# Altium project 2026MM.PrjPcb (part 7 of 10)
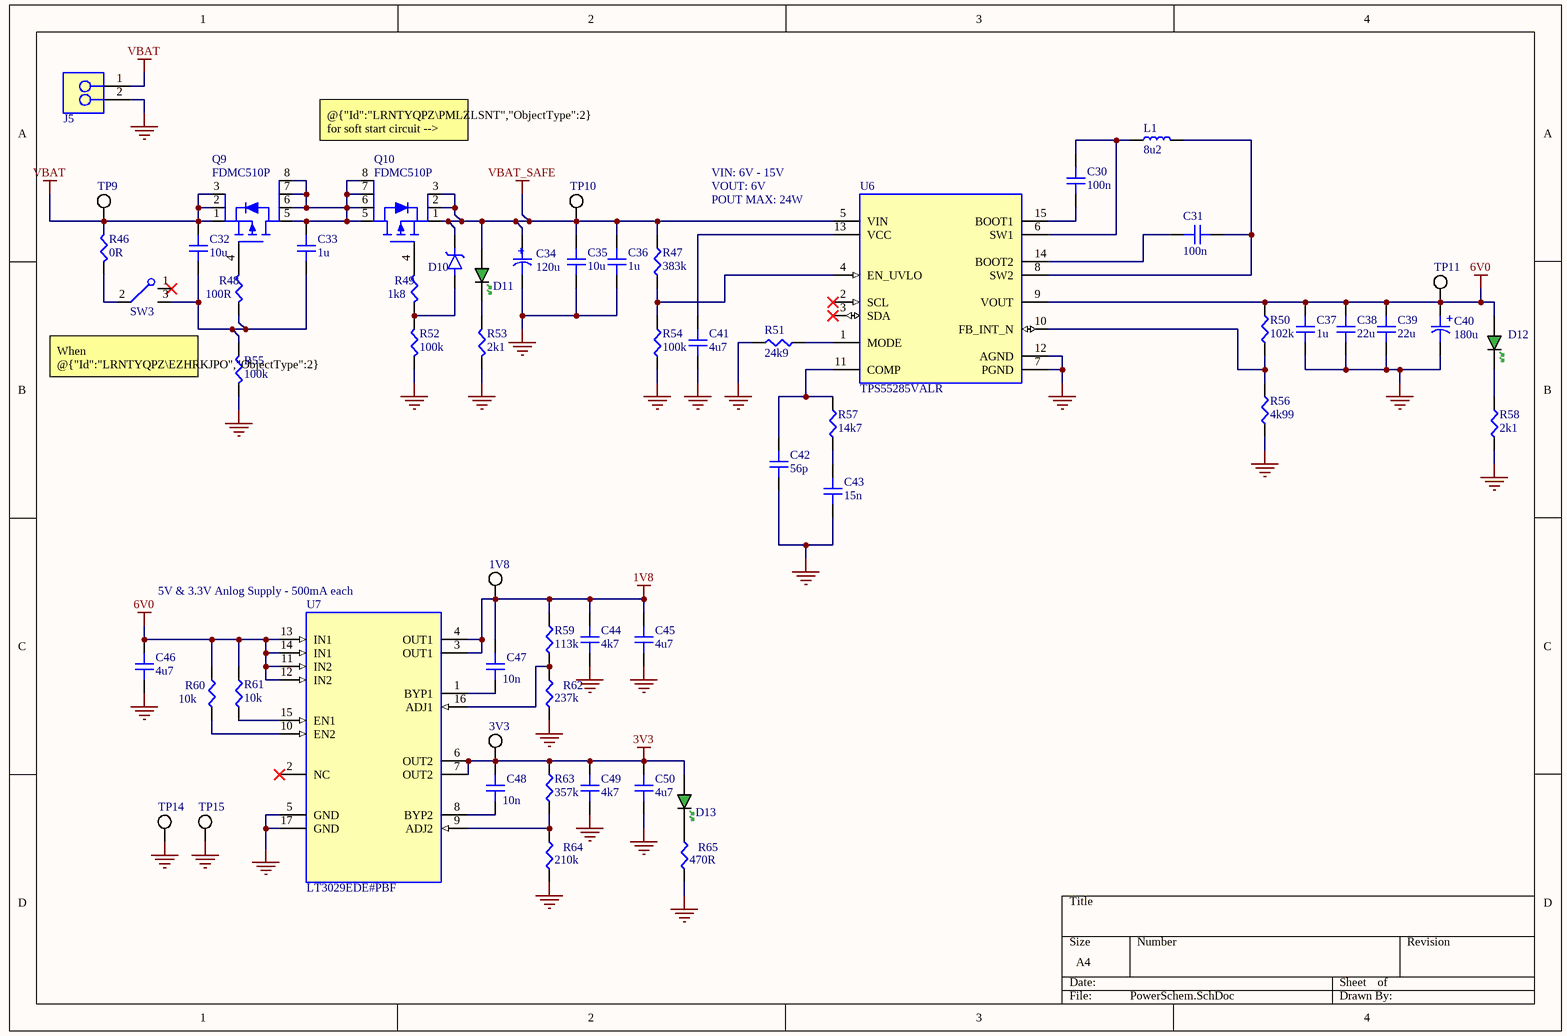
[diagram p7: PowerSchem.SchDoc]

## Sheet PowerSchem.SchDoc (continued)

### Library data of the parts (continued)
  C45: Value: 4u7; ComponentLink1URL: https://datasheet.octopart.com:443/CL05A475MO5NUNC-Samsung-Electro-Mechanics-datasheet-178175196.pdf?src-supplier=Farnell; ComponentLink1Description: https://datasheet.octopart.com:443/CL05A475MO5NUNC-Samsung-Electro-Mechanics-datasheet-178175196.pdf?src-supplier=Farnell; ComponentLink2URL: https://datasheet.octopart.com:443/CL05A475MO5NUNC-Samsung-Electro-Mechanics-datasheet-123102911.pdf?src-supplier=Future+Electronics; ComponentLink2Description: https://datasheet.octopart.com:443/CL05A475MO5NUNC-Samsung-Electro-Mechanics-datasheet-123102911.pdf?src-supplier=Future+Electronics; ComponentLink3URL: https://datasheet.octopart.com:443/CL05A475MO5NUNC-Samsung-Electro-Mechanics-datasheet-110226225.pdf?src-supplier=Future+Electronics; ComponentLink3Description: https://datasheet.octopart.com:443/CL05A475MO5NUNC-Samsung-Electro-Mechanics-datasheet-110226225.pdf?src-supplier=Future+Electronics; ComponentLink4URL: https://datasheet.octopart.com:443/CL05A475MO5NUNC-Samsung-Electro-Mechanics-datasheet-83567908.pdf?src-supplier=Future+Electronics; ComponentLink4Description: https://datasheet.octopart.com:443/CL05A475MO5NUNC-Samsung-Electro-Mechanics-datasheet-83567908.pdf?src-supplier=Future+Electronics; ComponentLink5URL: https://datasheet.octopart.com:443/CL05A475MO5NUNC-Samsung-Electro-Mechanics-datasheet-68297032.pdf?src-supplier=Future+Electronics; ComponentLink5Description: https://datasheet.octopart.com:443/CL05A475MO5NUNC-Samsung-Electro-Mechanics-datasheet-68297032.pdf?src-supplier=Future+Electronics; ComponentLink6URL: https://datasheet.octopart.com:443/CL05A475MO5NUNC-Samsung-Electro-Mechanics-datasheet-87580057.pdf?src-supplier=Future+Electronics; ComponentLink6Description: https://datasheet.octopart.com:443/CL05A475MO5NUNC-Samsung-Electro-Mechanics-datasheet-87580057.pdf?src-supplier=Future+Electronics; ComponentLink7URL: https://datasheet.octopart.com:443/CL05A475MO5NUNC-Samsung-Electro-Mechanics-datasheet-149136694.pdf?src-supplier=Future+Electronics; ComponentLink7Description: https://datasheet.octopart.com:443/CL05A475MO5NUNC-Samsung-Electro-Mechanics-datasheet-149136694.pdf?src-supplier=Future+Electronics; ComponentLink8URL: https://datasheet.octopart.com:443/GRM188R61E475KE11D-Murata-datasheet-27203393.pdf?src-supplier=Newark; ComponentLink8Description: https://datasheet.octopart.com:443/GRM188R61E475KE11D-Murata-datasheet-27203393.pdf?src-supplier=Newark; ComponentLink9URL: https://datasheet.octopart.com:443/GRM188R61E475KE11D-Murata-datasheet-44506546.pdf?src-supplier=Newark; ComponentLink9Description: https://datasheet.octopart.com:443/GRM188R61E475KE11D-Murata-datasheet-44506546.pdf?src-supplier=Newark; ComponentLink10URL: https://datasheet.octopart.com:443/GRM188R61E475KE11D-Murata-datasheet-62317199.pdf?src-supplier=element14+APAC; ComponentLink10Description: https://datasheet.octopart.com:443/GRM188R61E475KE11D-Murata-datasheet-62317199.pdf?src-supplier=element14+APAC; ComponentLink11URL: https://datasheet.octopart.com:443/GRM188R61E475KE11D-Murata-datasheet-14397282.pdf?src-supplier=Future+Electronics; ComponentLink11Description: https://datasheet.octopart.com:443/GRM188R61E475KE11D-Murata-datasheet-14397282.pdf?src-supplier=Future+Electronics; ComponentLink12URL: https://datasheet.octopart.com:443/GRM188R61E475KE11D-Murata-datasheet-78375012.pdf?src-supplier=Future+Electronics; ComponentLink12Description: https://datasheet.octopart.com:443/GRM188R61E475KE11D-Murata-datasheet-78375012.pdf?src-supplier=Future+Electronics; ComponentLink13URL: https://datasheet.octopart.com:443/GRM188R61E475KE11D-Murata-datasheet-179108037.pdf?src-supplier=Arrow.cn; ComponentLink13Description: https://datasheet.octopart.com:443/GRM188R61E475KE11D-Murata-datasheet-179108037.pdf?src-supplier=Arrow.cn; ComponentLink14URL: https://datasheet.octopart.com:443/GRM188R61E475KE11D-Murata-datasheet-165579666.pdf?src-supplier=TME; ComponentLink14Description: https://datasheet.octopart.com:443/GRM188R61E475KE11D-Murata-datasheet-165579666.pdf?src-supplier=TME; ComponentLink15URL: https://datasheet.octopart.com:443/GRM188R61E475KE11D-Murata-datasheet-141274968.pdf?src-supplier=Ciiva; ComponentLink15Description: https://datasheet.octopart.com:443/GRM188R61E475KE11D-Murata-datasheet-141274968.pdf?src-supplier=Ciiva; ComponentLink16URL: https://datasheet.octopart.com:443/GRM188R61E475KE11D-Murata-datasheet-140705133.pdf?src-supplier=Ciiva; ComponentLink16Description: https://datasheet.octopart.com:443/GRM188R61E475KE11D-Murata-datasheet-140705133.pdf?src-supplier=Ciiva; ComponentLink17URL: https://datasheet.octopart.com:443/GRM188R61E475KE11D-Murata-datasheet-138742897.pdf?src-supplier=Ciiva; ComponentLink17Description: https://datasheet.octopart.com:443/GRM188R61E475KE11D-Murata-datasheet-138742897.pdf?src-supplier=Ciiva; ComponentLink18URL: https://datasheet.octopart.com/GRM188R61E475KE11D-Murata-datasheet-12515295.pdf; ComponentLink18Description: https://datasheet.octopart.com/GRM188R61E475KE11D-Murata-datasheet-12515295.pdf; ComponentLink19URL: https://datasheet.octopart.com/GRM188R61E475KE11D-Murata-datasheet-12510076.pdf; ComponentLink19Description: https://datasheet.octopart.com/GRM188R61E475KE11D-Murata-datasheet-12510076.pdf; ComponentLink20URL: https://datasheet.octopart.com/GRM188R61E475KE11D-Murata-datasheet-11978611.pdf; ComponentLink20Description: https://datasheet.octopart.com/GRM188R61E475KE11D-Murata-datasheet-11978611.pdf; ComponentLink21URL: https://datasheet.octopart.com/GRM188R61E475KE11D-Murata-datasheet-10025737.pdf; ComponentLink21Description: https://datasheet.octopart.com/GRM188R61E475KE11D-Murata-datasheet-10025737.pdf; ComponentLink22URL: https://datasheet.octopart.com/GRM188R61E475KE11D-Murata-datasheet-8819587.pdf; ComponentLink22Description: https://datasheet.octopart.com/GRM188R61E475KE11D-Murata-datasheet-8819587.pdf; ComponentLink23URL: http://sigma.octopart.com:80/reach_statement/Murata-company-16.pdf?src-supplier=Compliance+Statements; ComponentLink23Description: http://sigma.octopart.com:80/reach_statement/Murata-company-16.pdf?src-supplier=Compliance+Statements; ComponentLink24URL: https://datasheet.octopart.com:443/GRT188C81E475KE13D-Murata-datasheet-149523579.pdf?src-supplier=Farnell; ComponentLink24Description: https://datasheet.octopart.com:443/GRT188C81E475KE13D-Murata-datasheet-149523579.pdf?src-supplier=Farnell; ComponentLink25URL: https://datasheet.octopart.com:443/GRT188C81E475KE13D-Murata-datasheet-67697744.pdf?src-supplier=Newark; ComponentLink25Description: https://datasheet.octopart.com:443/GRT188C81E475KE13D-Murata-datasheet-67697744.pdf?src-supplier=Newark; ComponentLink26URL: https://datasheet.octopart.com:443/GRT188C81E475KE13D-Murata-datasheet-141284540.pdf?src-supplier=Geoflip; ComponentLink26Description: https://datasheet.octopart.com:443/GRT188C81E475KE13D-Murata-datasheet-141284540.pdf?src-supplier=Geoflip; ComponentLink27URL: https://datasheet.octopart.com:443/GRT188C81E475KE13D-Murata-datasheet-165579666.pdf?src-supplier=TME; ComponentLink27Description: https://datasheet.octopart.com:443/GRT188C81E475KE13D-Murata-datasheet-165579666.pdf?src-supplier=TME; ComponentLink28URL: https://datasheet.octopart.com:443/GRT188C81E475KE13D-Murata-datasheet-140711288.pdf?src-supplier=Ciiva; ComponentLink28Description: https://datasheet.octopart.com:443/GRT188C81E475KE13D-Murata-datasheet-140711288.pdf?src-supplier=Ciiva; ComponentLink29URL: https://datasheet.octopart.com:443/GRT188C81E475KE13D-Murata-datasheet-138749062.pdf?src-supplier=Ciiva; ComponentLink29Description: https://datasheet.octopart.com:443/GRT188C81E475KE13D-Murata-datasheet-138749062.pdf?src-supplier=Ciiva
  C50: Value: 4u7; ComponentLink13URL: https://datasheet.octopart.com:443/GRM188R61E475KE11D-Murata-datasheet-179108037.pdf?src-supplier=Arrow.cn; ComponentLink13Description: https://datasheet.octopart.com:443/GRM188R61E475KE11D-Murata-datasheet-179108037.pdf?src-supplier=Arrow.cn; ComponentLink14URL: https://datasheet.octopart.com:443/GRM188R61E475KE11D-Murata-datasheet-165579666.pdf?src-supplier=TME; ComponentLink14Description: https://datasheet.octopart.com:443/GRM188R61E475KE11D-Murata-datasheet-165579666.pdf?src-supplier=TME; ComponentLink15URL: https://datasheet.octopart.com:443/GRM188R61E475KE11D-Murata-datasheet-141274968.pdf?src-supplier=Ciiva; ComponentLink15Description: https://datasheet.octopart.com:443/GRM188R61E475KE11D-Murata-datasheet-141274968.pdf?src-supplier=Ciiva; ComponentLink16URL: https://datasheet.octopart.com:443/GRM188R61E475KE11D-Murata-datasheet-140705133.pdf?src-supplier=Ciiva; ComponentLink16Description: https://datasheet.octopart.com:443/GRM188R61E475KE11D-Murata-datasheet-140705133.pdf?src-supplier=Ciiva; ComponentLink17URL: https://datasheet.octopart.com:443/GRM188R61E475KE11D-Murata-datasheet-138742897.pdf?src-supplier=Ciiva; ComponentLink17Description: https://datasheet.octopart.com:443/GRM188R61E475KE11D-Murata-datasheet-138742897.pdf?src-supplier=Ciiva; ComponentLink18URL: https://datasheet.octopart.com/GRM188R61E475KE11D-Murata-datasheet-12515295.pdf; ComponentLink18Description: https://datasheet.octopart.com/GRM188R61E475KE11D-Murata-datasheet-12515295.pdf; ComponentLink19URL: https://datasheet.octopart.com/GRM188R61E475KE11D-Murata-datasheet-12510076.pdf; ComponentLink19Description: https://datasheet.octopart.com/GRM188R61E475KE11D-Murata-datasheet-12510076.pdf; ComponentLink20URL: https://datasheet.octopart.com/GRM188R61E475KE11D-Murata-datasheet-11978611.pdf; ComponentLink20Description: https://datasheet.octopart.com/GRM188R61E475KE11D-Murata-datasheet-11978611.pdf; ComponentLink21URL: https://datasheet.octopart.com/GRM188R61E475KE11D-Murata-datasheet-10025737.pdf; ComponentLink21Description: https://datasheet.octopart.com/GRM188R61E475KE11D-Murata-datasheet-10025737.pdf; ComponentLink22URL: https://datasheet.octopart.com/GRM188R61E475KE11D-Murata-datasheet-8819587.pdf; ComponentLink22Description: https://datasheet.octopart.com/GRM188R61E475KE11D-Murata-datasheet-8819587.pdf; ComponentLink23URL: http://sigma.octopart.com:80/reach_statement/Murata-company-16.pdf?src-supplier=Compliance+Statements; ComponentLink23Description: http://sigma.octopart.com:80/reach_statement/Murata-company-16.pdf?src-supplier=Compliance+Statements; ComponentLink1URL: https://datasheet.octopart.com:443/GRT188C81E475KE13D-Murata-datasheet-149523579.pdf?src-supplier=Farnell; ComponentLink1Description: https://datasheet.octopart.com:443/GRT188C81E475KE13D-Murata-datasheet-149523579.pdf?src-supplier=Farnell; ComponentLink2URL: https://datasheet.octopart.com:443/GRT188C81E475KE13D-Murata-datasheet-67697744.pdf?src-supplier=Newark; ComponentLink2Description: https://datasheet.octopart.com:443/GRT188C81E475KE13D-Murata-datasheet-67697744.pdf?src-supplier=Newark; ComponentLink3URL: https://datasheet.octopart.com:443/GRT188C81E475KE13D-Murata-datasheet-141284540.pdf?src-supplier=Geoflip; ComponentLink3Description: https://datasheet.octopart.com:443/GRT188C81E475KE13D-Murata-datasheet-141284540.pdf?src-supplier=Geoflip; ComponentLink4URL: https://datasheet.octopart.com:443/GRT188C81E475KE13D-Murata-datasheet-165579666.pdf?src-supplier=TME; ComponentLink4Description: https://datasheet.octopart.com:443/GRT188C81E475KE13D-Murata-datasheet-165579666.pdf?src-supplier=TME; ComponentLink5URL: https://datasheet.octopart.com:443/GRT188C81E475KE13D-Murata-datasheet-140711288.pdf?src-supplier=Ciiva; ComponentLink5Description: https://datasheet.octopart.com:443/GRT188C81E475KE13D-Murata-datasheet-140711288.pdf?src-supplier=Ciiva; ComponentLink6URL: https://datasheet.octopart.com:443/GRT188C81E475KE13D-Murata-datasheet-138749062.pdf?src-supplier=Ciiva; ComponentLink6Description: https://datasheet.octopart.com:443/GRT188C81E475KE13D-Murata-datasheet-138749062.pdf?src-supplier=Ciiva; ComponentLink7URL: http://sigma.octopart.com:80/reach_statement/Murata-company-16.pdf?src-supplier=Compliance+Statements; ComponentLink7Description: http://sigma.octopart.com:80/reach_statement/Murata-company-16.pdf?src-supplier=Compliance+Statements
C42 = CAP: Ceramic Capacitor, Multilayer, Ceramic, 250V, 5% +Tol, 5% -Tol, C0G, 30ppm/Cel TC, 5.6e-05uF, Surface Mount, 0603; Manufacturer: Knowles; Manufacturer Part Number: QSCP251Q560J1GV001T; Value: 56p; Supplier 1: DigiKey; Supplier Part Number 1: 712-QSCP251Q560J1GV001TCT-ND; RoHS: Compliant; Category: Ceramic Capacitors; Stock: 30631; Pricing: 1=0.28, 10=0.162, 50=0.1176, 100=0.1038, 500=0.08066, 1000=0.07352 (USD); Case/Package: 0603; Country of Origin: USA; Dielectric Material: Ceramic; Export Control Classification Number (ECCN) Code: EAR99; Height: 760µm; Harmonized Tariff Schedule (HTS) Code: 8532.24.00.20; Introduction Date: 2022-02-04; Length: 1.57mm; Lifecycle Status: Production; Max Operating Temperature: 125°C; Min Operating Temperature: -55°C; Mounting Technology: Surface Mount; Number of Terminals: 2; REACH SVHC: Yes; Voltage Rating (DC): 250V; Width: 810µm; ComponentLink1URL: https://datasheet.octopart.com:443/QSCP251Q560J1GV001T-Johanson-datasheet-187816102.pdf?src-supplier=IHS; ComponentLink1Description: https://datasheet.octopart.com:443/QSCP251Q560J1GV001T-Johanson-datasheet-187816102.pdf?src-supplier=IHS
C43 = CAP: 0603 C 15NF Ceramic Multilayer Capacitor, 25 V, +125DEGC, C0G Dielectric, +/-5%; Manufacturer: Yageo Group; Manufacturer Part Number: C0603C153J3GACTU; Dissipation Factor: 0.1%; Temperature Coefficient: 30ppm/°C; Tolerance: 5%; Voltage: 25V; Value: 15n; Supplier 1: Newark; Supplier Part Number 1: C0603C153J3GACTU; RoHS: Compliant; Category: Ceramic Capacitors; Stock: 31000; Pricing: 4000=0.087, 8000=0.084 (USD); Case/Package: 0603; Case Code (Imperial): 0603; Case Code (Metric): 1608; China RoHS: Compliant; Contact Plating: Tin; Country of Origin: Mexico; Depth: 800µm; Dielectric: C0G; Dielectric Material: Ceramic; Export Control Classification Number (ECCN) Code: EAR99; Height: 800µm; Harmonized Tariff Schedule (HTS) Code: 8532.24.00.20; Introduction Date: 2008-06-06; Lead Free: Lead Free; Length: 1.6mm; Lifecycle Status: Production; Material: Ceramic; Max Operating Temperature: 125°C; Min Operating Temperature: -55°C; Mounting Technology: Surface Mount; Pins: 2; Number of Terminals: 2; Packaging: Cut Tape; REACH SVHC: Yes; Schedule B: 8532240020, 8532240020|8532240020, 8532240020|8532240020|8532240020, 8532240020|8532240020|8532240020|8532240020; Termination: SMD/SMT; Thickness: 863.6µm; Voltage Rating: 25V; Voltage Rating (DC): 25V; Width: 800µm; ComponentLink1URL: https://datasheet.octopart.com:443/C0603C153J3GACTU-KEMET-datasheet-178132257.pdf?src-supplier=IHS; ComponentLink1Description: https://datasheet.octopart.com:443/C0603C153J3GACTU-KEMET-datasheet-178132257.pdf?src-supplier=IHS; ComponentLink2URL: https://datasheet.octopart.com:443/C0603C153J3GAC7867-KEMET-datasheet-10540709.pdf?src-supplier=IHS; ComponentLink2Description: https://datasheet.octopart.com:443/C0603C153J3GAC7867-KEMET-datasheet-10540709.pdf?src-supplier=IHS; ComponentLink3URL: https://datasheet.octopart.com:443/C0603C153J3GACTU-KEMET-datasheet-137357764.pdf?src-supplier=Upverter; ComponentLink3Description: https://datasheet.octopart.com:443/C0603C153J3GACTU-KEMET-datasheet-137357764.pdf?src-supplier=Upverter; ComponentLink4URL: https://datasheet.octopart.com:443/C0603C153J3GACTU-KEMET-datasheet-68331921.pdf?src-supplier=Farnell; ComponentLink4Description: https://datasheet.octopart.com:443/C0603C153J3GACTU-KEMET-datasheet-68331921.pdf?src-supplier=Farnell; ComponentLink5URL: https://datasheet.octopart.com:443/C0603C153J3GACTU-KEMET-datasheet-102648314.pdf?src-supplier=Farnell; ComponentLink5Description: https://datasheet.octopart.com:443/C0603C153J3GACTU-KEMET-datasheet-102648314.pdf?src-supplier=Farnell; ComponentLink6URL: https://datasheet.octopart.com:443/C0603C153J3GACTU-Kemet-datasheet-5308203.pdf?src-supplier=Farnell; ComponentLink6Description: https://datasheet.octopart.com:443/C0603C153J3GACTU-Kemet-datasheet-5308203.pdf?src-supplier=Farnell; ComponentLink7URL: https://datasheet.octopart.com:443/C0603C153J3GACTU-KEMET-datasheet-176289261.pdf?src-supplier=element14+APAC; ComponentLink7Description: https://datasheet.octopart.com:443/C0603C153J3GACTU-KEMET-datasheet-176289261.pdf?src-supplier=element14+APAC; ComponentLink8URL: https://datasheet.octopart.com:443/C0603C153J3GACTU-KEMET-datasheet-178087916.pdf?src-supplier=element14+APAC; ComponentLink8Description: https://datasheet.octopart.com:443/C0603C153J3GACTU-KEMET-datasheet-178087916.pdf?src-supplier=element14+APAC; ComponentLink9URL: https://datasheet.octopart.com:443/C0603C153J3GACTU-Kemet-datasheet-66093294.pdf?src-supplier=element14+APAC; ComponentLink9Description: https://datasheet.octopart.com:443/C0603C153J3GACTU-Kemet-datasheet-66093294.pdf?src-supplier=element14+APAC; ComponentLink10URL: https://datasheet.octopart.com:443/C0603C153J3GACTU-Kemet-datasheet-66634713.pdf?src-supplier=element14+APAC; ComponentLink10Description: https://datasheet.octopart.com:443/C0603C153J3GACTU-Kemet-datasheet-66634713.pdf?src-supplier=element14+APAC; ComponentLink11URL: https://datasheet.octopart.com:443/C0603C153J3GACTU-KEMET-datasheet-157246123.pdf?src-supplier=Electro+Sonic; ComponentLink11Description: https://datasheet.octopart.com:443/C0603C153J3GACTU-KEMET-datasheet-157246123.pdf?src-supplier=Electro+Sonic; ComponentLink12URL: https://datasheet.octopart.com:443/C0603C153J3GAC7867-KEMET-datasheet-188512010.pdf?src-supplier=ODG+(Origin+Data+Global); ComponentLink12Description: https://datasheet.octopart.com:443/C0603C153J3GAC7867-KEMET-datasheet-188512010.pdf?src-supplier=ODG+(Origin+Data+Global); ComponentLink13URL: https://datasheet.octopart.com:443/C0603C153J3GACTU-KEMET-datasheet-176142193.pdf?src-supplier=Newark; ComponentLink13Description: https://datasheet.octopart.com:443/C0603C153J3GACTU-KEMET-datasheet-176142193.pdf?src-supplier=Newark; ComponentLink14URL: https://datasheet.octopart.com:443/C0603C153J3GACTU-KEMET-datasheet-101575703.pdf?src-supplier=Newark; ComponentLink14Description: https://datasheet.octopart.com:443/C0603C153J3GACTU-KEMET-datasheet-101575703.pdf?src-supplier=Newark; ComponentLink15URL: https://datasheet.octopart.com:443/C0603C153J3GACTU-Kemet-datasheet-62307647.pdf?src-supplier=Newark; ComponentLink15Description: https://datasheet.octopart.com:443/C0603C153J3GACTU-Kemet-datasheet-62307647.pdf?src-supplier=Newark; ComponentLink16URL: https://datasheet.octopart.com:443/C0603C153J3GACTU-KEMET-datasheet-193515620.pdf?src-supplier=Newark; ComponentLink16Description: https://datasheet.octopart.com:443/C0603C153J3GACTU-KEMET-datasheet-193515620.pdf?src-supplier=Newark; ComponentLink17URL: https://datasheet.octopart.com:443/C0603C153J3GACTU-Kemet-datasheet-67830794.pdf?src-supplier=TME; ComponentLink17Description: https://datasheet.octopart.com:443/C0603C153J3GACTU-Kemet-datasheet-67830794.pdf?src-supplier=TME; ComponentLink18URL: https://datasheet.octopart.com/C0603C153J3GACTU-KEMET-datasheet-84169754.pdf; ComponentLink18Description: https://datasheet.octopart.com/C0603C153J3GACTU-KEMET-datasheet-84169754.pdf; ComponentLink19URL: https://datasheet.octopart.com:443/C0603C153J3GACTU-Kemet-datasheet-60243840.pdf?src-supplier=RS+(Formerly+Allied+Electronics); ComponentLink19Description: https://datasheet.octopart.com:443/C0603C153J3GACTU-Kemet-datasheet-60243840.pdf?src-supplier=RS+(Formerly+Allied+Electronics); ComponentLink20URL: http://sigma.octopart.com:80/conflict_mineral_statement/Yageo-company-3.pdf?src-supplier=Compliance+Statements; ComponentLink20Description: http://sigma.octopart.com:80/conflict_mineral_statement/Yageo-company-3.pdf?src-supplier=Compliance+Statements; ComponentLink21URL: http://sigma.octopart.com:80/rohs_statement/Yageo-company-2.pdf?src-supplier=Compliance+Statements; ComponentLink21Description: http://sigma.octopart.com:80/rohs_statement/Yageo-company-2.pdf?src-supplier=Compliance+Statements
C47 C48 = CAP: Multilayer Ceramic Capacitors Mlcc - Smd/Smt 50V 0.01Uf X7R 0603 10%; Manufacturer: Yageo Group; Manufacturer Part Number: C0603C103K5RACTU; Dissipation Factor: 2.5%; Temperature Coefficient: 30ppm/°C; Value: 10n; Supplier 1: Avnet; Supplier Part Number 1: C0603C103K5RACTU; RoHS: Compliant; Category: Ceramic Capacitors; Stock: 2208000; Pricing: 4000=0.00842, 8000=0.00823, 16000=0.00795, 32000=0.00764, 64000=0.00735 (USD); Case/Package: 0603; Case Code (Imperial): 0603; China RoHS: Compliant; Contact Plating: Tin; Country of Origin: Mainland China, Mexico; Depth: 800µm; Dielectric: X7R; Dielectric Material: Ceramic; Export Control Classification Number (ECCN) Code: EAR99; Height: 800µm; Harmonized Tariff Schedule (HTS) Code: 8532.24.00.20; Introduction Date: 2011-07-27; Lead Free: Lead Free; Lead Pitch: 700µm; Length: 1.6mm; Lifecycle Status: Production; Material: Ceramic; Max Operating Temperature: 125°C; Min Operating Temperature: -55°C; Mounting Technology: Surface Mount; Pins: 2; Number of Terminals: 2; Packaging: Cut Tape; Radiation Hardening: No; REACH SVHC: Yes; Schedule B: 8532240020, 8532240020|8532240020, 8532240020|8532240020|8532240020, 8532240020|8532240020|8532240020|8532240020; Termination: SMD/SMT; Thickness: 863.6µm; Tolerance: 10%; Voltage: 50V; Voltage Rating: 50V; Voltage Rating (DC): 50V; Width: 800µm; ComponentLink1URL: https://datasheet.octopart.com:443/C0603C103K5RACTU-KEMET-datasheet-178445679.pdf?src-supplier=Farnell; ComponentLink1Description: https://datasheet.octopart.com:443/C0603C103K5RACTU-KEMET-datasheet-178445679.pdf?src-supplier=Farnell; ComponentLink2URL: https://datasheet.octopart.com:443/C0603C103K5RACTU-KEMET-datasheet-137357759.pdf?src-supplier=Farnell; ComponentLink2Description: https://datasheet.octopart.com:443/C0603C103K5RACTU-KEMET-datasheet-137357759.pdf?src-supplier=Farnell; ComponentLink3URL: https://datasheet.octopart.com:443/C0603C103K5RACTU-KEMET-datasheet-149521831.pdf?src-supplier=Farnell; ComponentLink3Description: https://datasheet.octopart.com:443/C0603C103K5RACTU-KEMET-datasheet-149521831.pdf?src-supplier=Farnell; ComponentLink4URL: https://datasheet.octopart.com:443/C0603C103K5RAC-TU-Kemet-datasheet-12608295.pdf?src-supplier=Farnell; ComponentLink4Description: https://datasheet.octopart.com:443/C0603C103K5RAC-TU-Kemet-datasheet-12608295.pdf?src-supplier=Farnell; ComponentLink5URL: https://datasheet.octopart.com:443/C0603C103K5RAC-TU-Kemet-datasheet-11992184.pdf?src-supplier=Farnell; ComponentLink5Description: https://datasheet.octopart.com:443/C0603C103K5RAC-TU-Kemet-datasheet-11992184.pdf?src-supplier=Farnell; ComponentLink6URL: https://datasheet.octopart.com:443/C0603C103K5RAC-TU-Kemet-datasheet-10942409.pdf?src-supplier=Farnell; ComponentLink6Description: https://datasheet.octopart.com:443/C0603C103K5RAC-TU-Kemet-datasheet-10942409.pdf?src-supplier=Farnell; ComponentLink7URL: https://datasheet.octopart.com:443/C0603C103K5RAC-TU-Kemet-datasheet-10404442.pdf?src-supplier=Farnell; ComponentLink7Description: https://datasheet.octopart.com:443/C0603C103K5RAC-TU-Kemet-datasheet-10404442.pdf?src-supplier=Farnell; ComponentLink8URL: https://datasheet.octopart.com:443/C0603C103K5RACTU-KEMET-datasheet-101575646.pdf?src-supplier=Farnell; ComponentLink8Description: https://datasheet.octopart.com:443/C0603C103K5RACTU-KEMET-datasheet-101575646.pdf?src-supplier=Farnell; ComponentLink9URL: https://datasheet.octopart.com:443/C0603C103K5RACTU.-Kemet-datasheet-41232427.pdf?src-supplier=Farnell; ComponentLink9Description: https://datasheet.octopart.com:443/C0603C103K5RACTU.-Kemet-datasheet-41232427.pdf?src-supplier=Farnell; ComponentLink10URL: https://datasheet.octopart.com:443/C0603C103K5RACTU-KEMET-datasheet-176142155.pdf?src-supplier=Farnell; ComponentLink10Description: https://datasheet.octopart.com:443/C0603C103K5RACTU-KEMET-datasheet-176142155.pdf?src-supplier=Farnell; ComponentLink11URL: https://datasheet.octopart.com:443/C0603C103K5RAC-TU-Kemet-datasheet-7833651.pdf?src-supplier=Farnell; ComponentLink11Description: https://datasheet.octopart.com:443/C0603C103K5RAC-TU-Kemet-datasheet-7833651.pdf?src-supplier=Farnell; ComponentLink12URL: https://datasheet.octopart.com:443/C0603C103K5RAC-TU-Kemet-datasheet-7601896.pdf?src-supplier=Farnell; ComponentLink12Description: https://datasheet.octopart.com:443/C0603C103K5RAC-TU-Kemet-datasheet-7601896.pdf?src-supplier=Farnell; ComponentLink13URL: https://datasheet.octopart.com:443/C0603C103K5RAC-TU-Kemet-datasheet-5316294.pdf?src-supplier=Farnell; ComponentLink13Description: https://datasheet.octopart.com:443/C0603C103K5RAC-TU-Kemet-datasheet-5316294.pdf?src-supplier=Farnell; ComponentLink14URL: https://datasheet.octopart.com:443/C0603C103K5RAC-TU-Kemet-datasheet-5314837.pdf?src-supplier=Farnell; ComponentLink14Description: https://datasheet.octopart.com:443/C0603C103K5RAC-TU-Kemet-datasheet-5314837.pdf?src-supplier=Farnell; ComponentLink15URL: https://datasheet.octopart.com:443/C0603C103K5RAC-TU-Kemet-datasheet-8092359.pdf?src-supplier=Farnell; ComponentLink15Description: https://datasheet.octopart.com:443/C0603C103K5RAC-TU-Kemet-datasheet-8092359.pdf?src-supplier=Farnell; ComponentLink16URL: https://datasheet.octopart.com:443/C0603C103K5RACTU-Kemet-datasheet-5314449.pdf?src-supplier=Farnell; ComponentLink16Description: https://datasheet.octopart.com:443/C0603C103K5RACTU-Kemet-datasheet-5314449.pdf?src-supplier=Farnell; ComponentLink17URL: https://datasheet.octopart.com:443/C0603C103K5RAC-TU-Kemet-datasheet-5390537.pdf?src-supplier=Farnell; ComponentLink17Description: https://datasheet.octopart.com:443/C0603C103K5RAC-TU-Kemet-datasheet-5390537.pdf?src-supplier=Farnell; ComponentLink18URL: https://datasheet.octopart.com:443/C0603C103K5RAC-TU-Kemet-datasheet-5314969.pdf?src-supplier=Farnell; ComponentLink18Description: https://datasheet.octopart.com:443/C0603C103K5RAC-TU-Kemet-datasheet-5314969.pdf?src-supplier=Farnell; ComponentLink19URL: https://datasheet.octopart.com:443/C0603C103K5RAC-TU-Kemet-datasheet-5314627.pdf?src-supplier=Farnell; ComponentLink19Description: https://datasheet.octopart.com:443/C0603C103K5RAC-TU-Kemet-datasheet-5314627.pdf?src-supplier=Farnell; ComponentLink20URL: https://datasheet.octopart.com:443/C0603C103K5RAC-TU-Kemet-datasheet-5389132.pdf?src-supplier=Farnell; ComponentLink20Description: https://datasheet.octopart.com:443/C0603C103K5RAC-TU-Kemet-datasheet-5389132.pdf?src-supplier=Farnell; ComponentLink21URL: https://datasheet.octopart.com:443/C0603C103K5RAC-TU-Kemet-datasheet-5313836.pdf?src-supplier=Farnell; ComponentLink21Description: https://datasheet.octopart.com:443/C0603C103K5RAC-TU-Kemet-datasheet-5313836.pdf?src-supplier=Farnell; ComponentLink22URL: https://datasheet.octopart.com:443/C0603C103K5RAC-TU-Kemet-datasheet-8111010.pdf?src-supplier=Farnell; ComponentLink22Description: https://datasheet.octopart.com:443/C0603C103K5RAC-TU-Kemet-datasheet-8111010.pdf?src-supplier=Farnell; ComponentLink23URL: https://datasheet.octopart.com:443/C0603C103K5RAC-TU-Kemet-datasheet-7541751.pdf?src-supplier=Farnell; ComponentLink23Description: https://datasheet.octopart.com:443/C0603C103K5RAC-TU-Kemet-datasheet-7541751.pdf?src-supplier=Farnell; ComponentLink24URL: https://datasheet.octopart.com:443/C0603C103K5RAC-TU-Kemet-datasheet-7627733.pdf?src-supplier=Farnell; ComponentLink24Description: https://datasheet.octopart.com:443/C0603C103K5RAC-TU-Kemet-datasheet-7627733.pdf?src-supplier=Farnell; ComponentLink25URL: https://datasheet.octopart.com:443/C0603C103K5RAC-TU-Kemet-datasheet-5315946.pdf?src-supplier=Farnell; ComponentLink25Description: https://datasheet.octopart.com:443/C0603C103K5RAC-TU-Kemet-datasheet-5315946.pdf?src-supplier=Farnell; ComponentLink26URL: https://datasheet.octopart.com:443/C0603C103K5RAC7867-KEMET-datasheet-182039592.pdf?src-supplier=IHS; ComponentLink26Description: https://datasheet.octopart.com:443/C0603C103K5RAC7867-KEMET-datasheet-182039592.pdf?src-supplier=IHS; ComponentLink27URL: https://datasheet.octopart.com:443/C0603C103K5RACTU-KEMET-datasheet-137357764.pdf?src-supplier=Upverter; ComponentLink27Description: https://datasheet.octopart.com:443/C0603C103K5RACTU-KEMET-datasheet-137357764.pdf?src-supplier=Upverter; ComponentLink28URL: https://datasheet.octopart.com:443/C0603C103K5RACTU-Kemet-datasheet-5313890.pdf?src-supplier=element14; ComponentLink28Description: https://datasheet.octopart.com:443/C0603C103K5RACTU-Kemet-datasheet-5313890.pdf?src-supplier=element14; ComponentLink29URL: https://datasheet.octopart.com:443/C0603C103K5RACTU-KEMET-datasheet-157246124.pdf?src-supplier=Electro+Sonic; ComponentLink29Description: https://datasheet.octopart.com:443/C0603C103K5RACTU-KEMET-datasheet-157246124.pdf?src-supplier=Electro+Sonic; ComponentLink30URL: https://datasheet.octopart.com:443/C0603C103K5RACTU-KEMET-datasheet-32036385.pdf?src-supplier=Electro+Sonic; ComponentLink30Description: https://datasheet.octopart.com:443/C0603C103K5RACTU-KEMET-datasheet-32036385.pdf?src-supplier=Electro+Sonic; ComponentLink31URL: https://datasheet.octopart.com:443/C0603C103K5RAC7867-KEMET-datasheet-188512054.pdf?src-supplier=ODG+(Origin+Data+Global); ComponentLink31Description: https://datasheet.octopart.com:443/C0603C103K5RAC7867-KEMET-datasheet-188512054.pdf?src-supplier=ODG+(Origin+Data+Global); ComponentLink32URL: https://datasheet.octopart.com:443/C0603C103K5RACTU-KEMET-datasheet-176142164.pdf?src-supplier=Newark; ComponentLink32Description: https://datasheet.octopart.com:443/C0603C103K5RACTU-KEMET-datasheet-176142164.pdf?src-supplier=Newark; ComponentLink33URL: https://datasheet.octopart.com:443/C0603C103K5RACTU-Kemet-datasheet-27203261.pdf?src-supplier=Newark; ComponentLink33Description: https://datasheet.octopart.com:443/C0603C103K5RACTU-Kemet-datasheet-27203261.pdf?src-supplier=Newark; ComponentLink34URL: https://datasheet.octopart.com:443/C0603C103K5RACTU-KEMET-datasheet-164512540.pdf?src-supplier=TME; ComponentLink34Description: https://datasheet.octopart.com:443/C0603C103K5RACTU-KEMET-datasheet-164512540.pdf?src-supplier=TME; ComponentLink35URL: https://datasheet.octopart.com:443/C0603C103K5RACTU-KEMET-datasheet-81639432.pdf?src-supplier=TME; ComponentLink35Description: https://datasheet.octopart.com:443/C0603C103K5RACTU-KEMET-datasheet-81639432.pdf?src-supplier=TME; ComponentLink36URL: https://datasheet.octopart.com:443/C0603C103K5RACTU-KEMET-datasheet-68331906.pdf?src-supplier=TME; ComponentLink36Description: https://datasheet.octopart.com:443/C0603C103K5RACTU-KEMET-datasheet-68331906.pdf?src-supplier=TME; ComponentLink37URL: https://datasheet.octopart.com:443/C0603C103K5RACTU-KEMET-datasheet-110724412.pdf?src-supplier=RS+(Formerly+Allied+Electronics); ComponentLink37Description: https://datasheet.octopart.com:443/C0603C103K5RACTU-KEMET-datasheet-110724412.pdf?src-supplier=RS+(Formerly+Allied+Electronics); ComponentLink38URL: https://datasheet.octopart.com:443/C0603C103K5RACTU-Kemet-datasheet-464.pdf?src-supplier=RS+(Formerly+Allied+Electronics); ComponentLink38Description: https://datasheet.octopart.com:443/C0603C103K5RACTU-Kemet-datasheet-464.pdf?src-supplier=RS+(Formerly+Allied+Electronics); ComponentLink39URL: https://datasheet.octopart.com/C0603C103K5RACTU-KEMET-datasheet-84169754.pdf; ComponentLink39Description: https://datasheet.octopart.com/C0603C103K5RACTU-KEMET-datasheet-84169754.pdf; ComponentLink40URL: https://datasheet.octopart.com:443/C0603C103K5RACTU-Kemet-datasheet-22084244.pdf?src-supplier=element14+APAC; ComponentLink40Description: https://datasheet.octopart.com:443/C0603C103K5RACTU-Kemet-datasheet-22084244.pdf?src-supplier=element14+APAC; ComponentLink41URL: https://datasheet.octopart.com:443/C0603C103K5RACTU-Kemet-datasheet-11898999.pdf?src-supplier=Arrow+Electronics; ComponentLink41Description: https://datasheet.octopart.com:443/C0603C103K5RACTU-Kemet-datasheet-11898999.pdf?src-supplier=Arrow+Electronics; ComponentLink42URL: https://datasheet.octopart.com:443/C0603C103K5RAC7867-KEMET-datasheet-164857143.pdf?src-supplier=Burklin+Elektronik; ComponentLink42Description: https://datasheet.octopart.com:443/C0603C103K5RAC7867-KEMET-datasheet-164857143.pdf?src-supplier=Burklin+Elektronik; ComponentLink43URL: http://sigma.octopart.com:80/conflict_mineral_statement/Yageo-company-3.pdf?src-supplier=Compliance+Statements; ComponentLink43Description: http://sigma.octopart.com:80/conflict_mineral_statement/Yageo-company-3.pdf?src-supplier=Compliance+Statements; ComponentLink44URL: http://sigma.octopart.com:80/rohs_statement/Yageo-company-2.pdf?src-supplier=Compliance+Statements; ComponentLink44Description: http://sigma.octopart.com:80/rohs_statement/Yageo-company-2.pdf?src-supplier=Compliance+Statements
D10 = Zenner: ESD9X5.0ST5G Series 6.2 V 65 pF TVS Diode for ESD Protection - SOD-923; Manufacturer: onsemi; Manufacturer Lifecycle Status: ACTIVE; Breakdown Voltage: 6.2V; Clamping Voltage: 12.3V; Direction: Unidirectional; Element Configuration: Single; ESD Protection: Yes; Forward Voltage: 1.1V; Leakage Current: 1µA; Max Junction Temperature (Tj): 150°C; Max Power Dissipation: 150mW; Max Surge Current: 8.7A; Number of Channels: 1; Operating Supply Voltage: 5V; Peak Pulse Power: 107W; Power Line Protection: No; Test Current: 1mA; Supplier 1: Future Electronics; Supplier Part Number 1: ESD9X5.0ST5G; Manufacturer Part Number: ESD9X5.0ST5G; RoHS: Compliant; Category: TVS Diodes; Stock: 200000; Pricing: 8000=0.0268, 24000=0.0262, 32000=0.0261, 80000=0.0255, 120000=0.025 (USD); Value: 65pF; Case/Package: SOD-923-2; China RoHS: Compliant; Composition: Zener; Contact Plating: Tin; Depth: 600µm; Halogen Free: Halogen Free; Height: 400µm; Lead Free: Lead Free; Length: 800µm; Lifecycle Status: Production; Max Breakdown Voltage: 6.2V; Max Operating Temperature: 150°C; Max Reverse Leakage Current: 1µA; Min Breakdown Voltage: 6.2V; Min Operating Temperature: -55°C; Number of Circuits: 1; Number of Elements: 1; Number of Lines: 1; Pins: 2; Number of Terminals: 2; Number of Unidirectional Channels: 1; Packaging: Tape and Reel; Peak Pulse Current: 8.7A; Peak Reverse Current: 1µA; Polarity: Unidirectional; Radiation Hardening: No; REACH SVHC: Yes; Reverse Breakdown Voltage: 6.2V; Reverse Standoff Voltage: 5V; Schedule B: 8536300000, 8536300000|8536300000|8536300000|8536300000|8536300000|8536300000|8536300000|8536300000|8536300000|8536300000|8536300000|8536300000|8536300000|8536300000|8536300000|8536300000|8536300000|8536300000|8536300000|8536300000|8536300000|8536300000|8536300000|85; Termination: SMD/SMT; Width: 650µm; Working Voltage: 5V; ComponentLink1URL: https://datasheet.octopart.com:443/ESD9X5.0ST5G-ON-Semiconductor-datasheet-8330357.pdf?src-supplier=Upverter; ComponentLink1Description: https://datasheet.octopart.com:443/ESD9X5.0ST5G-ON-Semiconductor-datasheet-8330357.pdf?src-supplier=Upverter; ComponentLink2URL: https://datasheet.octopart.com:443/ESD9X5.0ST5G-onsemi-datasheet-168568609.pdf?src-supplier=Upverter; ComponentLink2Description: https://datasheet.octopart.com:443/ESD9X5.0ST5G-onsemi-datasheet-168568609.pdf?src-supplier=Upverter; ComponentLink3URL: https://datasheet.octopart.com:443/ESD9X5.0ST5G-ON-Semiconductor-datasheet-139009868.pdf?src-supplier=Electro+Sonic; ComponentLink3Description: https://datasheet.octopart.com:443/ESD9X5.0ST5G-ON-Semiconductor-datasheet-139009868.pdf?src-supplier=Electro+Sonic; ComponentLink4URL: https://datasheet.octopart.com:443/ESD9X5.0ST5G-onsemi-datasheet-180958921.pdf?src-supplier=IHS; ComponentLink4Description: https://datasheet.octopart.com:443/ESD9X5.0ST5G-onsemi-datasheet-180958921.pdf?src-supplier=IHS; ComponentLink5URL: https://datasheet.octopart.com:443/ESD9X5.0ST5G-ON-Semiconductor-datasheet-12513463.pdf?src-supplier=Newark; ComponentLink5Description: https://datasheet.octopart.com:443/ESD9X5.0ST5G-ON-Semiconductor-datasheet-12513463.pdf?src-supplier=Newark; ComponentLink6URL: https://datasheet.octopart.com:443/ESD9X5.0ST5G-onsemi-datasheet-189128587.pdf?src-supplier=Master+Electronics; ComponentLink6Description: https://datasheet.octopart.com:443/ESD9X5.0ST5G-onsemi-datasheet-189128587.pdf?src-supplier=Master+Electronics; ComponentLink7URL: https://datasheet.octopart.com:443/ESD9X5.0ST5G-onsemi-datasheet-164667579.pdf?src-supplier=Newchip+Electronics+Limited; ComponentLink7Description: https://datasheet.octopart.com:443/ESD9X5.0ST5G-onsemi-datasheet-164667579.pdf?src-supplier=Newchip+Electronics+Limited; ComponentLink8URL: https://datasheet.octopart.com:443/ESD9X5.0ST5G-ON-Semiconductor-datasheet-14047635.pdf?src-supplier=iiiC; ComponentLink8Description: https://datasheet.octopart.com:443/ESD9X5.0ST5G-ON-Semiconductor-datasheet-14047635.pdf?src-supplier=iiiC; ComponentLink9URL: http://sigma.octopart.com:80/15540786/rohs_certificate/ON-Semiconductor-ESD9X5.0ST5G.pdf?src-supplier=Compliance+Statements; ComponentLink9Description: http://sigma.octopart.com:80/15540786/rohs_certificate/ON-Semiconductor-ESD9X5.0ST5G.pdf?src-supplier=Compliance+Statements; ComponentLink10URL: http://sigma.octopart.com:80/15676178/materials_sheet/ON-Semiconductor-ESD9X5.0ST5G.csv?src-supplier=Compliance+Statements; ComponentLink10Description: http://sigma.octopart.com:80/15676178/materials_sheet/ON-Semiconductor-ESD9X5.0ST5G.csv?src-supplier=Compliance+Statements; ComponentLink11URL: http://sigma.octopart.com:80/150607609/rohs_statement/ON-Semiconductor-ESD9X5.0ST5G.pdf?src-supplier=Compliance+Statements; ComponentLink11Description: http://sigma.octopart.com:80/150607609/rohs_statement/ON-Semiconductor-ESD9X5.0ST5G.pdf?src-supplier=Compliance+Statements; ComponentLink12URL: http://sigma.octopart.com:80/reach_statement/ON-Semiconductor-company-79.pdf?src-supplier=Compliance+Statements; ComponentLink12Description: http://sigma.octopart.com:80/reach_statement/ON-Semiconductor-company-79.pdf?src-supplier=Compliance+Statements; ComponentLink13URL: https://octopart.com:443/opatz8j6/c1?t=U4xq248CjZk49aqVlr5k0EZ1S20O7hXZC5x3rHWSH-sYxZ_igJwI8JXMjxjum5nk7b2LPFvSUdjhtWeLCCyF45HKJ3gQrOw2ICCLdwIt4F_CeAv9k9h4bPg01xsOqGsl4_WPHk2-sHZisKbPVHvESszEH42MI_EGcnWZn37s8EDrb9R9sRHl5QrF73OS571ory3wTq49jEdwCvmsvOyGlnMZqdznSgUnAulqt8UeVTtCWi1h0LjaV3_jenB72zXObhJcrUkKGX87J72uvMIaqlf2gdrzqerpU4qgDLbtRMl999sH-387FE5OvjKwPt4qFBwoXQia9kWdxdoPHguyJMxxDQ6CZJ78I1Jz7wf_&src-supplier=Compliance+Statements; ComponentLink13Description: https://octopart.com:443/opatz8j6/c1?t=U4xq248CjZk49aqVlr5k0EZ1S20O7hXZC5x3rHWSH-sYxZ_igJwI8JXMjxjum5nk7b2LPFvSUdjhtWeLCCyF45HKJ3gQrOw2ICCLdwIt4F_CeAv9k9h4bPg01xsOqGsl4_WPHk2-sHZisKbPVHvESszEH42MI_EGcnWZn37s8EDrb9R9sRHl5QrF73OS571ory3wTq49jEdwCvmsvOyGlnMZqdznSgUnAulqt8UeVTtCWi1h0LjaV3_jenB72zXObhJcrUkKGX87J72uvMIaqlf2gdrzqerpU4qgDLbtRMl999sH-387FE5OvjKwPt4qFBwoXQia9kWdxdoPHguyJMxxDQ6CZJ78I1Jz7wf_&src-supplier=Compliance+Statements; ComponentLink14URL: https://octopart.com:443/opatz8j6/c1?t=3pWjA3sury-vXDZ6jn5EtAlCMoxYtX1AYxU0u-L05MRKzzY3i90hWYZqBJ7nD0FpcxQU6NVvWSfrj8spDvkDVcv6hBGs2FKejoF387FKwRHUXxrKuAp20zxQf1xviP5DOSGH0oDp6nciOnSgABqDgBRfE1IdXVb1HgMibrXHg5ILIw0i4bTNvinhI9nbqtNHG7c2z1LCxAmzkrm1UggRYQnaU9WfKM8lDyf7V15dE3D-xK99Oqq1XK1trMaZ5tCK2HDTe7-XsgP0FTthRAXuAn3xjXwE5sHZ4Tfbg-hc08R_QhUItco4PPzxqp_Ni38_sf5Aw8nlbFeh5fp6Pc1W3BfPLWy2YwzTcFmoPFUupg&src-supplier=Compliance+Statements; ComponentLink14Description: https://octopart.com:443/opatz8j6/c1?t=3pWjA3sury-vXDZ6jn5EtAlCMoxYtX1AYxU0u-L05MRKzzY3i90hWYZqBJ7nD0FpcxQU6NVvWSfrj8spDvkDVcv6hBGs2FKejoF387FKwRHUXxrKuAp20zxQf1xviP5DOSGH0oDp6nciOnSgABqDgBRfE1IdXVb1HgMibrXHg5ILIw0i4bTNvinhI9nbqtNHG7c2z1LCxAmzkrm1UggRYQnaU9WfKM8lDyf7V15dE3D-xK99Oqq1XK1trMaZ5tCK2HDTe7-XsgP0FTthRAXuAn3xjXwE5sHZ4Tfbg-hc08R_QhUItco4PPzxqp_Ni38_sf5Aw8nlbFeh5fp6Pc1W3BfPLWy2YwzTcFmoPFUupg&src-supplier=Compliance+Statements
D11-D13 = LED_Green: LED yellow green 0603 wavelength 567.5~576.5nm light intensity 4.5~28mcd Front Mounting; Manufacturer: Diodes Inc.; Manufacturer Part Number: LTST-C193KGKT-5A; Forward Current: 30mA; Forward Voltage: 1.9V; Illumination Color: Green, Yellow; Lens Color: Clear, Colorless; Lens Style: Clear, Colorless, Diffused, Rectangular; Lens Transparency: Clear; Luminous Intensity: 16.25mcd; Number of Circuits: 1; Peak Wavelength: 574nm; Power Dissipation: 50mW; Power Rating: 75mW; Reverse Voltage: 5V; Shape: Rectangular; Test Current: 5mA; Viewing Angle: 130°; Wavelength: 571nm; Supplier 1: Avnet; Supplier Part Number 1: LTST-C193KGKT-5A; RoHS: Compliant; Category: LEDs; Stock: 95000; Pricing: 5000=0.03977, 10000=0.03887, 20000=0.03797, 40000=0.03708, 80000=0.03618 (USD); Case/Package: 0603; Case Code (Imperial): 0603; Case Code (Metric): 1608; China RoHS: Compliant; Color: Green; Country of Origin: Mainland China, Thailand; Depth: 800µm; Dominant Wavelength: 576.5nm; Export Control Classification Number (ECCN) Code: EAR99; Height: 350µm; Harmonized Tariff Schedule (HTS) Code: 8541.40.20.00; Introduction Date: 2007-03-15; Lead Free: Lead Free; Length: 1.6mm; Lifecycle Status: Production; Max Operating Temperature: 85°C; Manufacturer Package Identifier: LTST-C193KGKT-5A; Min Operating Temperature: -55°C; Mounting Technology: Surface Mount; Number of Elements: 1; Number of LEDs: 1; Pins: 2; Number of Terminals: 2; Radiation Hardening: No; REACH SVHC: Yes; Schedule B: 8541402000, 8541402000|8541402000|8541402000|8541402000|8541402000|8541402000|8541402000|8541402000|8541402000|8541402000|8541402000|8541402000|8541402000|8541402000|8541402000|8541402000|8541402000|8541402000|8541402000|8541402000|8541402000|8541402000|8541402000|85; Terminal Pitch: 1.5mm; Width: 800µm; ComponentLink1URL: https://datasheet.octopart.com:443/LTST-C193KGKT-5A-Lite-On-datasheet-141439008.pdf?src-supplier=ODG+(Origin+Data+Global); ComponentLink1Description: https://datasheet.octopart.com:443/LTST-C193KGKT-5A-Lite-On-datasheet-141439008.pdf?src-supplier=ODG+(Origin+Data+Global); ComponentLink2URL: https://datasheet.octopart.com:443/LTST-C193KGKT-5A-Lite-On-datasheet-86397324.pdf?src-supplier=Upverter; ComponentLink2Description: https://datasheet.octopart.com:443/LTST-C193KGKT-5A-Lite-On-datasheet-86397324.pdf?src-supplier=Upverter; ComponentLink3URL: https://datasheet.octopart.com:443/LTST-C193KGKT-5A-Lite-On-datasheet-12546740.pdf?src-supplier=_legacy+Avnet; ComponentLink3Description: https://datasheet.octopart.com:443/LTST-C193KGKT-5A-Lite-On-datasheet-12546740.pdf?src-supplier=_legacy+Avnet; ComponentLink4URL: https://datasheet.octopart.com:443/LTST-C193KGKT-5A-Lite-On-datasheet-165573808.pdf?src-supplier=TME; ComponentLink4Description: https://datasheet.octopart.com:443/LTST-C193KGKT-5A-Lite-On-datasheet-165573808.pdf?src-supplier=TME; ComponentLink5URL: https://datasheet.octopart.com:443/LTST-C193KGKT-5A-Lite-On-datasheet-62340975.pdf?src-supplier=TME; ComponentLink5Description: https://datasheet.octopart.com:443/LTST-C193KGKT-5A-Lite-On-datasheet-62340975.pdf?src-supplier=TME; ComponentLink6URL: https://datasheet.octopart.com:443/LTST-C193KGKT-5A-Lite-On-datasheet-14174969.pdf?src-supplier=iiiC; ComponentLink6Description: https://datasheet.octopart.com:443/LTST-C193KGKT-5A-Lite-On-datasheet-14174969.pdf?src-supplier=iiiC
J5 = 2POS: Board Connector, 2 Contact(s), 1 Row(s), Male, Straight, Solder Terminal; Manufacturer: JST; Manufacturer Part Number: B2B-XH-A; Contact Resistance: 20mΩ; Current Rating: 3A; Insulation Resistance: 1GΩ; Number of Positions: 2; Supplier 1: DigiKey; Supplier Part Number 1: 455-B2B-XH-A-ND; RoHS: Compliant; Category: Card Edge Connectors; Stock: 87864; Pricing: 1=0.1, 10=0.087, 100=0.0742, 500=0.06618, 1000=0.06301, 5000=0.05624, 10000=0.05355 (USD); Color: White; Contact Material: Brass; Gender: Male; Housing Material: Nylon; Lifecycle Status: Production; Max Operating Temperature: 85°C; Min Operating Temperature: -25°C; Pins: 2; Number of Rows: 1; Orientation: Straight; Terminal Pitch: 2.5mm; ComponentLink1URL: https://datasheet.octopart.com:443/B2B-XH-A-JST-datasheet-157850277.pdf?src-supplier=IHS; ComponentLink1Description: https://datasheet.octopart.com:443/B2B-XH-A-JST-datasheet-157850277.pdf?src-supplier=IHS; ComponentLink2URL: https://datasheet.octopart.com:443/B2B-XH-A-JST-datasheet-10026044.pdf?src-supplier=TME; ComponentLink2Description: https://datasheet.octopart.com:443/B2B-XH-A-JST-datasheet-10026044.pdf?src-supplier=TME
L1 = IND_FIXED: Ind Power Shielded Wirewound 8.2uH 20% 100kHz Metal Alloy Powder 8A (6.6 X 6.4 X 5.8mm) T/R; Manufacturer: Bourns; Manufacturer Part Number: SRP6060FA-8R2M; DC Resistance (DCR): 24.8mΩ; Number of Circuits: 1; Saturation Current: 8.5A; Self Resonant Frequency: 14MHz; Value: 8u2; Supplier 1: Avnet; Supplier Part Number 1: 33AK4499; RoHS: Compliant; Category: Fixed Inductors; Stock: 422; Pricing: 1=1.6, 10=1.38, 25=1.26, 50=1.23, 100=1.2, 250=1.17, 500=1.08 (USD); China RoHS: Compliant; Composition: Wirewound; Contact Plating: Tin; Export Control Classification Number (ECCN) Code: EAR99; Height: 5.8mm; Harmonized Tariff Schedule (HTS) Code: 8504.50.80.00; Inductance Tolerance: 20%; Introduction Date: 2018-06-07; Length: 6.6mm; Lifecycle Status: Production; Max Current Rating: 8A; Max Operating Temperature: 155°C; Min Operating Temperature: -55°C; Number of Terminals: 2; Ratings: AEC-Q200; REACH SVHC: Yes; RMS Current (Irms): 8A; Schedule B: 8504500000, 8504500000|8504500000|8504500000|8504500000|8504500000; ESR: 24.8mΩ; Shielding: Shielded; Test Frequency: 100kHz; Tolerance: 20%; Width: 6.4mm; ComponentLink1URL: https://datasheet.octopart.com:443/SRP6060FA-8R2M-Bourns-datasheet-179985811.pdf?src-supplier=JRH+Electronics; ComponentLink1Description: https://datasheet.octopart.com:443/SRP6060FA-8R2M-Bourns-datasheet-179985811.pdf?src-supplier=JRH+Electronics; ComponentLink2URL: https://datasheet.octopart.com:443/SRP6060FA-8R2M-Bourns-datasheet-110646386.pdf?src-supplier=Master+Electronics; ComponentLink2Description: https://datasheet.octopart.com:443/SRP6060FA-8R2M-Bourns-datasheet-110646386.pdf?src-supplier=Master+Electronics; ComponentLink3URL: https://datasheet.octopart.com:443/SRP6060FA-8R2M-Bourns-datasheet-165058501.pdf?src-supplier=Burklin+Elektronik; ComponentLink3Description: https://datasheet.octopart.com:443/SRP6060FA-8R2M-Bourns-datasheet-165058501.pdf?src-supplier=Burklin+Elektronik; ComponentLink4URL: http://sigma.octopart.com:80/conflict_mineral_statement/Bourns-company-36.pdf?src-supplier=Compliance+Statements; ComponentLink4Description: http://sigma.octopart.com:80/conflict_mineral_statement/Bourns-company-36.pdf?src-supplier=Compliance+Statements